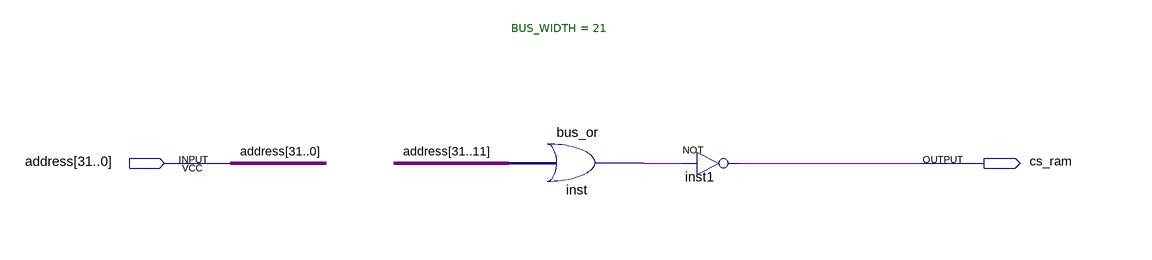
[diagram p0: schematic sheet]
// Quartus schematic chip_select.bdf as structural Verilog: 2 symbols, 2 pins
module chip_select (
  input  [31:0] address,
  output cs_ram
);

  wire inst_out;

  bus_or #(.BUS_WIDTH(21)) inst (.in(address[31:11]), .out(inst_out));
  not inst1 (cs_ram, inst_out);
endmodule
